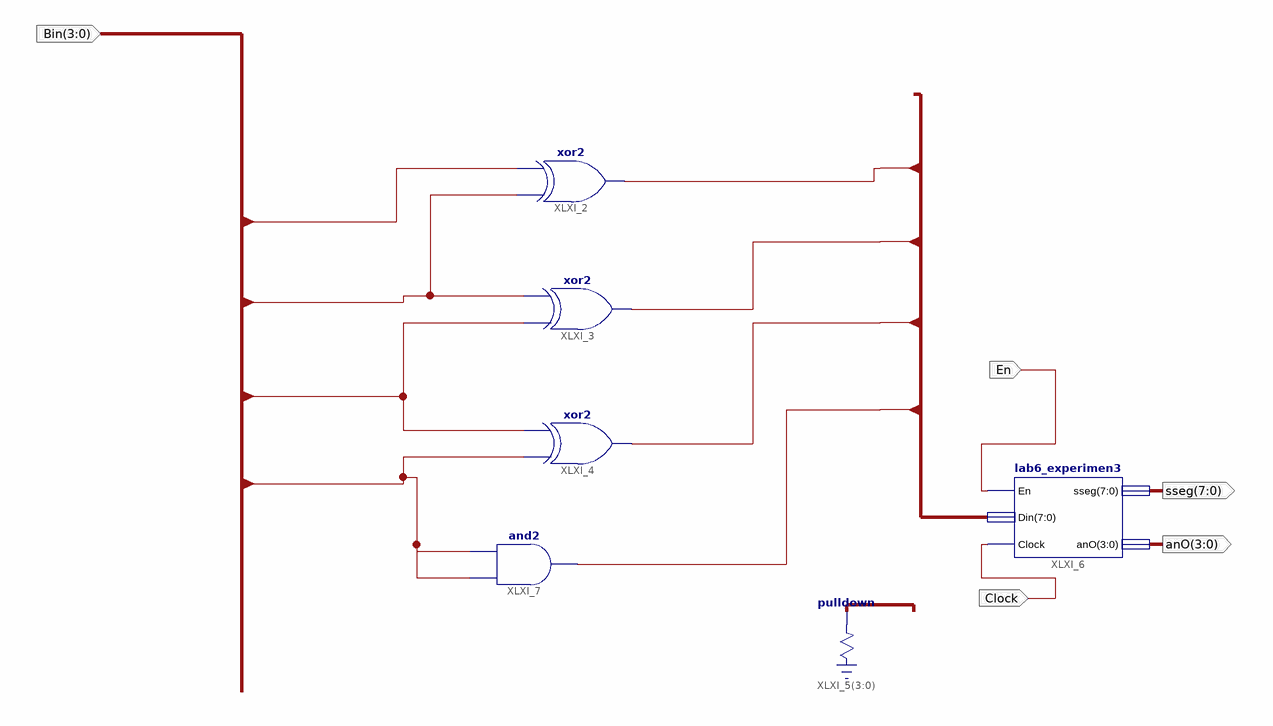
[diagram p0: schematic sheet 1]
// Xilinx ISE schematic lab6_experiment7_graycode.sch (spartan3e) as structural Verilog: 6 symbols, 5 ports
module lab6_experiment7_graycode (
  input  [3:0] Bin,
  input  En,
  input  Clock,
  output [7:0] sseg,
  output [3:0] anO
);

  wire [7:0] Din;

  xor XLXI_2 (Din[0], Bin[1], Bin[0]);
  xor XLXI_3 (Din[1], Bin[2], Bin[1]);
  xor XLXI_4 (Din[2], Bin[3], Bin[2]);
  \pulldown  XLXI_5[3:0] (.O(Din[7:4]));
  lab6_experimen3 XLXI_6 (.En(En), .Din(Din), .Clock(Clock), .sseg(sseg), .anO(anO));
  and XLXI_7 (Din[3], Bin[3], Bin[3]);
endmodule
